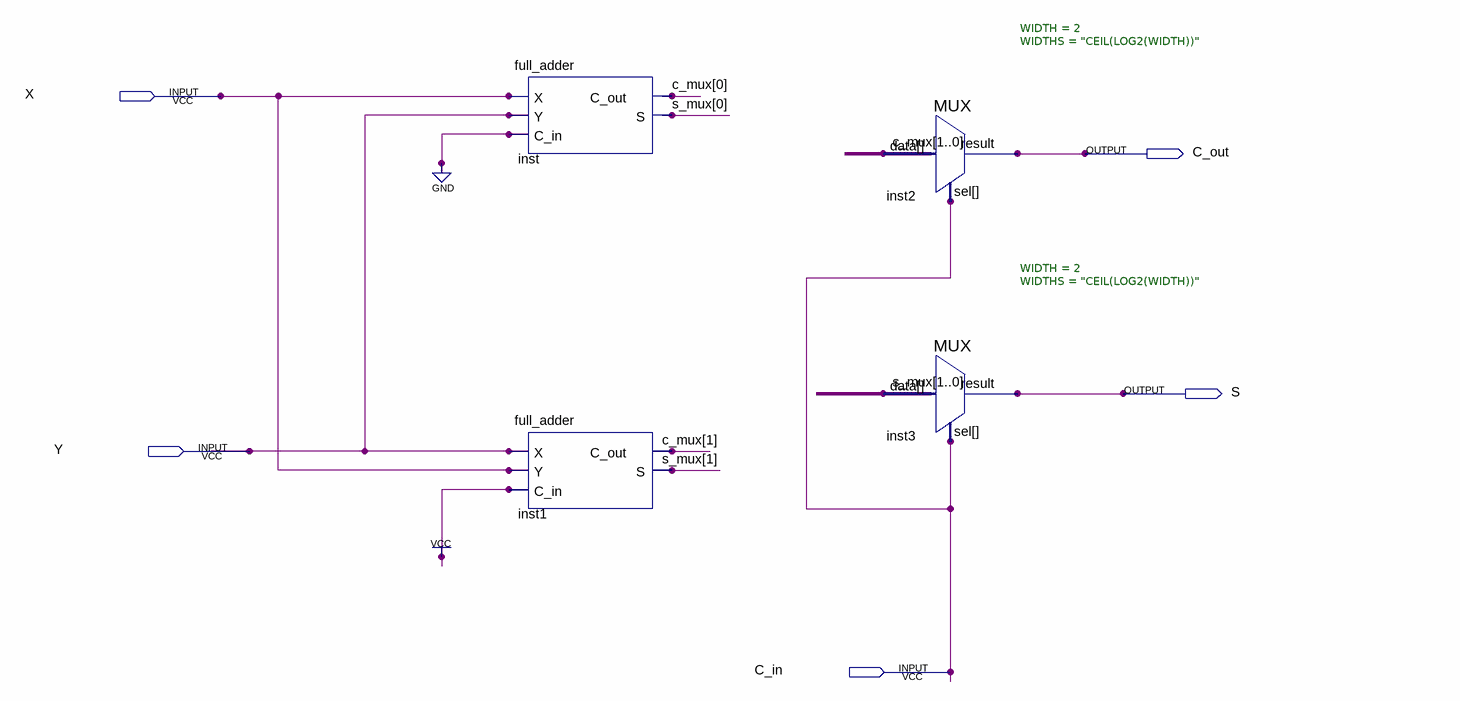
[diagram p0: schematic sheet]
// Quartus schematic carry_select_adder_unit.bdf as structural Verilog: 4 symbols, 5 pins
module carry_select_adder_unit (
  input  X,
  input  Y,
  input  C_in,
  output C_out,
  output S
);

  wire [1:0] c_mux, s_mux;

  full_adder inst (.X(X), .Y(Y), .C_in(1'b0), .C_out(c_mux[0]), .S(s_mux[0]));
  full_adder inst1 (.X(Y), .Y(X), .C_in(1'b1), .C_out(c_mux[1]), .S(s_mux[1]));
  MUX #(.WIDTH(2), .WIDTHS("CEIL(LOG2(WIDTH))")) inst2 (.data(c_mux), .sel(C_in), .result(C_out));
  MUX #(.WIDTH(2), .WIDTHS("CEIL(LOG2(WIDTH))")) inst3 (.data(s_mux), .sel(C_in), .result(S));
endmodule
